# Altium schematic sheet Sheet4.SchDoc
size A; SheetNumber: 2; SheetTotal: 2
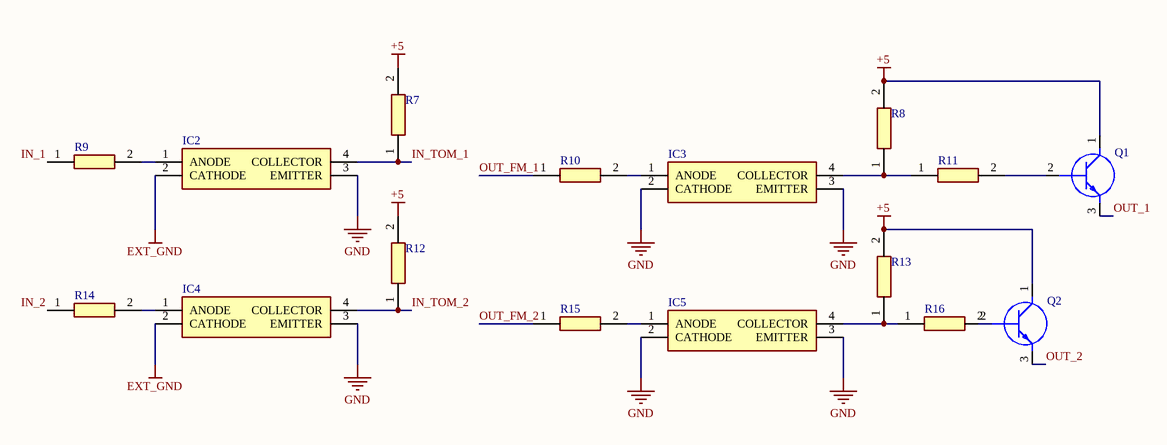
[diagram p0: Sheet4.SchDoc]

## Parts
IC2  PC817X2NSZ0F  [DIP762W60P254L458H400Q4N]  (value not drawn)
IC3  PC817X2NSZ0F  [DIP762W60P254L458H400Q4N]  (value not drawn)
IC4  PC817X2NSZ0F  [DIP762W60P254L458H400Q4N]  (value not drawn)
IC5  PC817X2NSZ0F  [DIP762W60P254L458H400Q4N]  (value not drawn)
Q1  BC547BG  [TO-92_(TO-226)]  (value not drawn)
Q2  BC547BG  [TO-92_(TO-226)]  (value not drawn)
R7  RN73C2A10KLTDF  [RESC2012X65N]  (value not drawn)
R8  RN73C2A10KLTDF  [RESC2012X65N]  (value not drawn)
R9  PCF0805R-1K0BI  [RESC2012X65N]  (value not drawn)
R10  PCF0805R-1K0BI  [RESC2012X65N]  (value not drawn)
R11  PCF0805R-1K0BI  [RESC2012X65N]  (value not drawn)
R12  RN73C2A10KLTDF  [RESC2012X65N]  (value not drawn)
R13  RN73C2A10KLTDF  [RESC2012X65N]  (value not drawn)
R14  PCF0805R-1K0BI  [RESC2012X65N]  (value not drawn)
R15  PCF0805R-1K0BI  [RESC2012X65N]  (value not drawn)
R16  PCF0805R-1K0BI  [RESC2012X65N]  (value not drawn)

## Nets
+5: Q1.1(C) Q2.1(C) R7.2 R8.2 R12.2 R13.2
EXT_GND: IC2.2(CATHODE) IC4.2(CATHODE)
GND: IC2.3(EMITTER) IC3.2(CATHODE) IC3.3(EMITTER) IC4.3(EMITTER) IC5.2(CATHODE) IC5.3(EMITTER)
IN_1: R9.1
IN_2: R14.1
IN_TOM_1: IC2.4(COLLECTOR) R7.1
IN_TOM_2: IC4.4(COLLECTOR) R12.1
OUT_1: Q1.3(E)
OUT_2: Q2.3(E)
OUT_FM_1: R10.1
OUT_FM_2: R15.1
NetIC2_1: IC2.1(ANODE) R9.2
NetIC3_1: IC3.1(ANODE) R10.2
NetIC3_4: IC3.4(COLLECTOR) R8.1 R11.1
NetIC4_1: IC4.1(ANODE) R14.2
NetIC5_1: IC5.1(ANODE) R15.2
NetIC5_4: IC5.4(COLLECTOR) R13.1 R16.1
NetQ1_2: Q1.2(B) R11.2
NetQ2_2: Q2.2(B) R16.2

## Library data of the parts
IC2-IC5 = PC817X2NSZ0F: Integrated Circuit; Manufacturer_Name: Sharp Microelectronics; Datasheet Link: https://datasheet.datasheetarchive.com/originals/distributors/Datasheets_SAMA/458e45842a103a05998fcebbd6f7366e.pdf; Height: 4mm; Manufacturer_Part_Number: PC817X2NSZ0F; Mouser Part Number: N/A; Mouser Price/Stock: https://www.mouser.co.uk/ProductDetail/Sharp-Microelectronics/PC817X2NSZ0F?qs=6kT3pPPHxnU7uYWM8Yy85A%3D%3D
Q1 Q2 = BC547BG: Transistor BJT NPN; Manufacturer_Name: onsemi; Datasheet Link: https://www.onsemi.com/download/data-sheet/pdf/BC546-D.PDF; Height: 5.33mm; Manufacturer_Part_Number: BC547BG; Mouser Part Number: N/A; Mouser Price/Stock: http://www.mouser.com/Search/ProductDetail.aspx?qs=NSmgnqlvnz5NIKIycfR5CQ%3d%3d; Arrow Part Number: BC547BG; Arrow Price/Stock: http://www.arrow.com/en/products/bc547bg/on-semiconductor
R7 R8 R12 R13 = RN73C2A10KLTDF: Resistor; Manufacturer_Name: TE Connectivity; Datasheet Link: http://docs-europe.electrocomponents.com/webdocs/1488/0900766b814885e5.pdf; Height: 0.65mm; Manufacturer_Part_Number: RN73C2A10KLTDF; Mouser Part Number: 279-RN73C2A10KLTDF; Mouser Price/Stock: https://www.mouser.co.uk/ProductDetail/TE-Connectivity-Holsworthy/RN73C2A10KLTDF?qs=1Hpg7qxOs69sC8pHBMR1GQ%3D%3D
R9-R11 R14-R16 = PCF0805R-1K0BI: Resistor; Manufacturer_Name: TT Electronics; Datasheet Link: https://componentsearchengine.com/Datasheets/1/PCF0805-13-10KBT1.pdf; Height: 0.65mm; Manufacturer_Part_Number: PCF0805R-1K0BI; Mouser Part Number: 756-PCF0805R1K0BI; Mouser Price/Stock: https://www.mouser.co.uk/ProductDetail/Welwyn-Components-TT-Electronics/PCF0805R-1K0BI?qs=mbEfOQsdCzdnsA0Coprz5g%3D%3D